# Altium schematic sheet POWER.SchDoc
size A; SheetNumber: 5; SheetTotal: 8
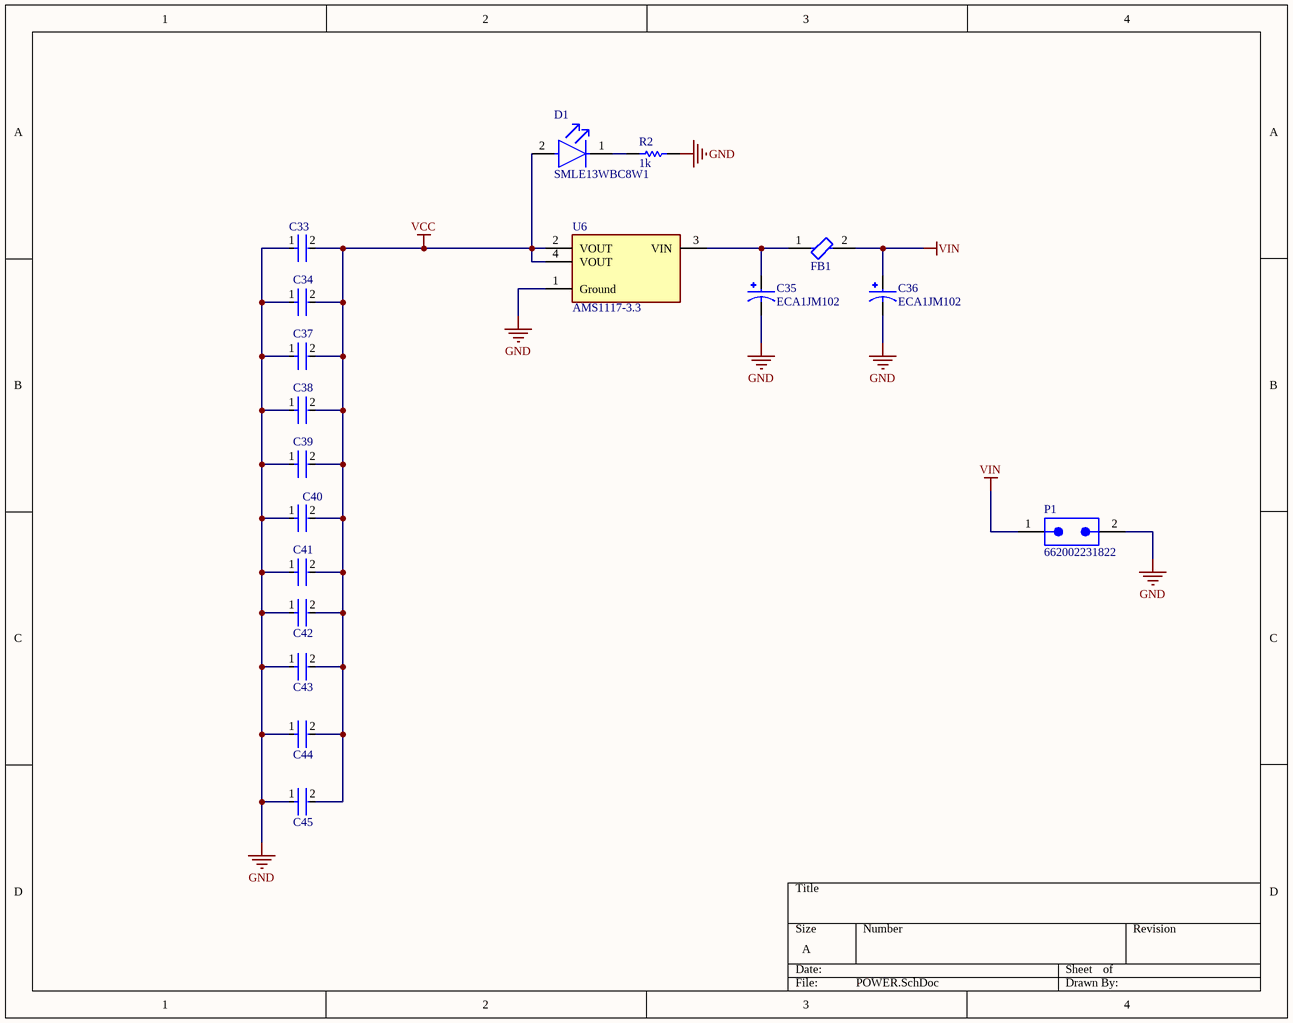
[diagram p0: POWER.SchDoc]

## Parts
C33  C0603X6S0G474M030BC  [FP-C0603-030-0_03-MFG]  (value not drawn)
C34  C0603X6S0G474M030BC  [FP-C0603-030-0_03-MFG]  (value not drawn)
C35  ECA1JM102  [CAPPRD750W80D1600H2500]
C36  ECA1JM102  [CAPPRD750W80D1600H2500]
C37  C0603X6S0G474M030BC  [FP-C0603-030-0_03-MFG]  (value not drawn)
C38  C0603X6S0G474M030BC  [FP-C0603-030-0_03-MFG]  (value not drawn)
C39  C0603X6S0G474M030BC  [FP-C0603-030-0_03-MFG]  (value not drawn)
C40  C0603X6S0G474M030BC  [FP-C0603-030-0_03-MFG]  (value not drawn)
C41  C0603X6S0G474M030BC  [FP-C0603-030-0_03-MFG]  (value not drawn)
C42  C0603X6S0G474M030BC  [FP-C0603-030-0_03-MFG]  (value not drawn)
C43  C0603X6S0G474M030BC  [FP-C0603-030-0_03-MFG]  (value not drawn)
C44  C0603X6S0G474M030BC  [FP-C0603-030-0_03-MFG]  (value not drawn)
C45  C0603X6S0G474M030BC  [FP-C0603-030-0_03-MFG]  (value not drawn)
D1  SMLE13WBC8W1  [FP-SMLE13WBC8W1-MFG]
FB1  BLM18KG121TN1D  [FP-BLM18-0_15-t0_6-d1_2-IPC_A]  (value not drawn)
P1  662002231822  [662002231822]
R2  1k  [RESC2013X60X35ML10T20]
U6  AMS1117-3.3  [FP-AMS1117-IPC_C]

## Nets
GND: C33.1 C34.1 C35.N C36.N C37.1 C38.1 C39.1 C40.1 C41.1 C42.1 C43.1 C44.1 C45.1 P1.2 R2.1 U6.1(Ground)
VCC: C33.2 C34.2 C37.2 C38.2 C39.2 C40.2 C41.2 C42.2 C43.2 C44.2 C45.2 D1.2(A) U6.2(VOUT) U6.4(VOUT)
VIN: C36.P FB1.2 P1.1
NetC35_P: C35.P FB1.1 U6.3(VIN)
NetD1_1: D1.1(C) R2.2

## Library data of the parts
C33 C34 C37-C45 = CMP-08246-002636-1: Multilayer Ceramic Capacitors 470nF ±20% 4V X6S SMD 0201; Dielectric Material: Ceramic; RoHS Compliant: Yes; Case Code (Imperial): 0201; Voltage Rating: 4V; Series: C; Case/Package: 0201; Max Operating Temperature: 105°C; Width: 0.3mm; Termination: SMD/SMT; Lead Free: Lead Free; Capacitance: 470nF; Tolerance: 20%; Mount: Surface Mount; Thickness: 0.013inch; Package Quantity: 15000; Case Code (Metric): 0603; Height: 0.3mm; Weight: 6E-06oz; Length: 0.024inch; Packaging: Tape and Reel; Min Operating Temperature: -55°C; Voltage Rating (DC): 4V; Dielectric: X6S
C35 C36 = ECA1JM102: 1000ÂµF 63V Aluminum Electrolytic Capacitors Radial, Can 2000 Hrs @ 85Â°C; MF: Panasonic; Availability: Not in stock; Check_prices: https://www.snapeda.com/parts/ECA1JM102/Panasonic/view-part/5782477/?ref=eda; Package: RADIAL-2 Panasonic; SnapEDA_Link: https://www.snapeda.com/parts/ECA1JM102/Panasonic/view-part/5782477/?ref=snap; MP: ECA1JM102; Price: None; Value: *
D1 = CMP-08952-000004-1: LED WHITE 0603 SMD; Manufacturer: Rohm; Luminous Intensity: 140mcd; Led Orientation: Top View; Reverse Voltage: 5V; Forward Voltage: 2.9V; Forward Current: 5mA; Power Dissipation: 66mW; Temperature Range Low: -40°C; Digikey Description: LED WHITE 0603 SMD; Temperature Range High: +85°C; Temperature: -40°C to +85°C; Manufacturer Part Number: SMLE13WBC8W1; Colour: White; Mouser Description: Standard LEDs - SMD ExceLED White LED 120mcd 5mA; Octopart: https://octopart.com/smle13wbc8w1-rohm-22224565; Automotive: No; Device Class L2: LEDs; Lead Free: Yes; ComponentLink2URL: https://media.digikey.com/pdf/Data%20Sheets/Rohm%20PDFs/SMLE13WBC8W1_Spec.pdf; Device Class L3: unset; Package: 0; RoHS: TRUE; Height: 0.4mm; Category: Diode; Device Class L1: Optoelectronics; ComponentLink2Description: Datasheet
FB1 = CMP-0686-00554-8: FERRITE BEAD 120 OHM 0603 1LN; Max Current Rating: 3A; DC Resistance (DCR): 30mR; Impedance: 120R; Number of Lines: 1; Test Frequency: 100MHz; Tolerance: 25%; Package Quantity: 4000; Min Operating Temperature: -55°C; Termination: SMD/SMT; REACH SVHC: No SVHC; Core Material: Ferrite; Material: Ferrite; Current Rating: 3A; Height: 0.8mm; Number of Pins: 2; Case/Package: 0603; Case Code (Imperial): 0603; Series: BLM18K; Packaging: Tape and Reel; Inductor Type: FERRITE BEAD; Lead Free: Lead Free; Width: 0.8mm; Case Code (Metric): 1608; Number of Circuits: 1; Max DC Current: 3A; Depth: 0.95mm; Max Operating Temperature: 125°C; Length: 1.6mm; RoHS Compliant: Yes
P1 = CMP-1502-00340-2: NexarPartId: 8917600; Contact Resistance: 10mΩ; Connector Type: Male Pin, Socket; Row Spacing: 2.9972mm; Number of Contacts: 2; Gender: Male; Operating Supply Voltage: 250V; Current Rating: 5A; Pitch: 3mm; Insulation Resistance: 1GΩ; Contact Material: Copper; Lead Pitch: 3mm; Mount: Surface Mount; Number of Pins: 2; Max Operating Temperature: 105°C; Contact Plating: Tin; RoHS: Compliant; Color: Black; Width: 6.7mm; Termination: Solder; Fastening Type: Ramp; Number of Rows: 2; Height: 9.9mm; Min Operating Temperature: -40°C; Length: 6.7mm; Orientation: Vertical; REACH SVHC: Unknown; Housing Material: Nylon; Number of Positions: 2
R2 = CMP-2100-03673-1: Chip Resistor, 0 Ohm, Jumper, +/- 5%, 0.125 W, -55 to 155 degC, 0805 (2012 Metric), RoHS, Tape and Reel; Manufacturer: Yageo; Power Rating: 125mW; Resistance: 0mOhm; Voltage Rating (DC): 150V; Temperature Coefficient: 200ppm/degreesC; Height: 0.5mm; Depth: 1.25mm; Case Code (Imperial): 0805; Lead Free: LeadFree; Military Standard: Not; Package Description: 2-Pin Surface Mounted Device, Body 2 x 1.25 mm; Case Code (Metric): 2012; Composition: ThickFilm; Voltage Rating: 150V; Manufacturer URL: http://www.yageo.com/; Packaging: TapeandReel; Package Reference: 0805; REACH SVHC: Unknown; Tolerance: 5%; Case/Package: 0805; Max Operating Temperature: 155degC; Number of Pins: 2; Min Operating Temperature: -55degC; RoHSCompliant: true; Length: 2mm; Datasheet URL: http://www.yageo.com/NewPortal/yageodocoutput?fileName=/pdf/R-Chip/PYu-RC_Group_51_RoHS_L_5.pdf; Termination: SMD/SMT; Radiation Hardening: No; Width: 1.25mm; Contact Plating: Tin; Datasheet Version: Rev. 5, 10/2016
U6 = CMP-209535-000001-1: LDO Voltage Regulators 1A, 3.3V; Manufacturer: Advanced Monolithic Systems; Dropout Voltage: 1.1V; Output Type: Fixed; Nominal Supply Current: 5mA; Max Power Dissipation: 1.2W; Max Supply Voltage: 15V; Number Of Outputs: 1; Standoff Height: 0.64mm; Max Junction Temp: +125°C; Height: 1.8mm; Package: AMS1117; Device Class L2: Power Management ICs; ComponentLink2Description: Datasheet; ComponentLink2URL: http://www.advanced-monolithic.com/pdf/ds1117.pdf; Category: IC; RoHS: TRUE; Automotive: No; Device Class L1: Integrated Circuits (ICs); Output Current: 1A; Device Class L3: Voltage Regulators - Linear; Temperature: -40°C to +125°C; Output Voltage: 3.3V; Manufacturer Part Number: AMS1117-3.3; Temperature Range Low: -40°C; Octopart: https://octopart.com/ams1117-3.3-advanced+monolithic+systems-25899300; Lead Free: Yes; Ipc Land Pattern Name: SOT229P700X180-4; Temperature Range High: +125°C